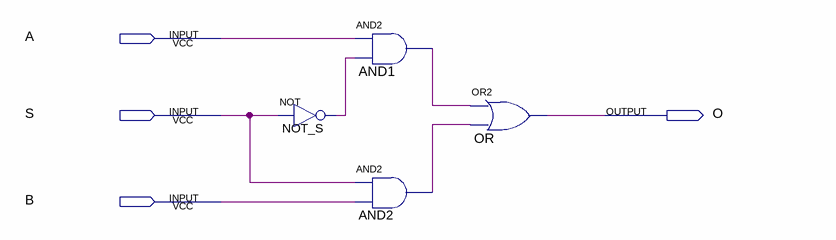
[diagram p0: schematic sheet]
// Quartus schematic MUX2to1_primitive.bdf as structural Verilog: 4 symbols, 4 pins
module MUX2to1_primitive (
  input  A,
  input  S,
  input  B,
  output O
);

  wire AND1_out, AND2_out, NOT_S_out;

  not NOT_S (NOT_S_out, S);
  and AND1 (AND1_out, A, NOT_S_out);
  and AND2 (AND2_out, S, B);
  or OR (O, AND1_out, AND2_out);
endmodule
